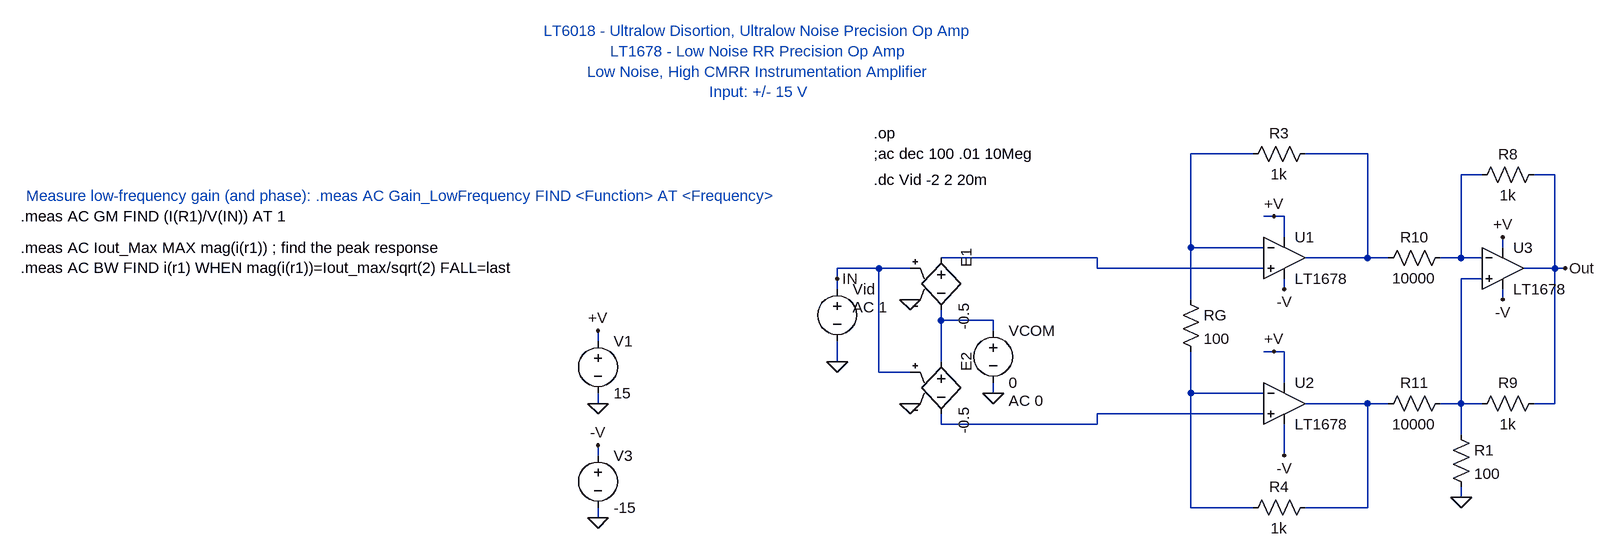
[diagram p0: schematic AI_VI_Howland_Gm.asc]
AI_VI_Howland_Gm.asc, the LTspice schematic file:
Version 4
SHEET 1 2004 1192
WIRE 416 48 320 48
WIRE 592 48 496 48
WIRE 768 80 736 80
WIRE 880 80 848 80
WIRE 448 144 432 144
WIRE 464 144 448 144
WIRE 464 176 464 144
WIRE 320 192 320 48
WIRE 432 192 320 192
WIRE 800 192 800 176
WIRE 176 208 -64 208
WIRE 592 208 592 48
WIRE 592 208 496 208
WIRE 624 208 592 208
WIRE 736 208 736 80
WIRE 736 208 704 208
WIRE 768 208 736 208
WIRE -160 224 -224 224
WIRE -112 224 -160 224
WIRE 176 224 176 208
WIRE 432 224 176 224
WIRE 880 224 880 80
WIRE 880 224 832 224
WIRE 896 224 880 224
WIRE -224 240 -224 224
WIRE 768 240 736 240
WIRE -224 256 -224 240
WIRE 464 256 464 240
WIRE 320 272 320 192
WIRE 800 272 800 256
WIRE -64 304 -64 288
WIRE 16 304 -64 304
WIRE 16 320 16 304
WIRE -592 336 -592 320
WIRE 448 352 432 352
WIRE 464 352 448 352
WIRE -224 368 -224 336
WIRE -64 368 -64 304
WIRE -160 384 -160 224
WIRE -112 384 -160 384
WIRE 464 400 464 352
WIRE 16 416 16 400
WIRE 320 416 320 352
WIRE 432 416 320 416
WIRE -592 432 -592 416
WIRE 592 432 496 432
WIRE 624 432 592 432
WIRE 736 432 736 240
WIRE 736 432 704 432
WIRE 768 432 736 432
WIRE 880 432 880 224
WIRE 880 432 848 432
WIRE 432 448 176 448
WIRE -64 464 -64 448
WIRE 176 464 176 448
WIRE 176 464 -64 464
WIRE 736 480 736 432
WIRE -592 512 -592 496
WIRE 464 512 464 464
WIRE 736 576 736 560
WIRE 320 592 320 416
WIRE 416 592 320 592
WIRE 592 592 592 432
WIRE 592 592 496 592
WIRE -592 608 -592 592
FLAG -592 432 0
FLAG -592 608 0
FLAG -592 320 +V
FLAG -592 496 -V
FLAG 448 144 +V
FLAG 16 416 0
FLAG 464 512 -V
FLAG 896 224 Out
FLAG 800 176 +V
FLAG 800 272 -V
FLAG 448 352 +V
FLAG 464 256 -V
FLAG -224 240 IN
FLAG -224 368 0
FLAG -112 272 0
FLAG -112 432 0
FLAG 736 576 0
DATAFLAG 320 192 ""
DATAFLAG 592 208 ""
DATAFLAG 592 432 ""
DATAFLAG 880 224 ""
DATAFLAG 736 208 ""
DATAFLAG 736 256 ""
SYMBOL Opamps\\LT1678 800 224 R0
SYMATTR InstName U3
SYMBOL voltage -592 320 R0
WINDOW 123 0 0 Left 2
WINDOW 39 0 0 Left 2
SYMATTR InstName V1
SYMATTR Value 15
SYMBOL voltage -592 496 R0
WINDOW 123 0 0 Left 2
WINDOW 39 0 0 Left 2
SYMATTR InstName V3
SYMATTR Value -15
SYMBOL voltage -224 240 R0
WINDOW 123 24 44 Left 2
WINDOW 39 24 117 Left 2
WINDOW 3 24 72 Left 2
SYMATTR Value2 AC 1
SYMATTR Value ""
SYMATTR InstName Vid
SYMBOL res 864 64 R90
WINDOW 0 0 56 VBottom 2
WINDOW 3 32 56 VTop 2
SYMATTR InstName R8
SYMATTR Value 1k
SYMATTR SpiceLine tol=1 pwr=0.1
SYMBOL res 864 416 R90
WINDOW 0 0 56 VBottom 2
WINDOW 3 32 56 VTop 2
SYMATTR InstName R9
SYMATTR Value 1k
SYMATTR SpiceLine tol=1 pwr=0.1
SYMBOL res 720 192 R90
WINDOW 0 0 56 VBottom 2
WINDOW 3 32 56 VTop 2
SYMATTR InstName R10
SYMATTR Value 10000
SYMATTR SpiceLine tol=1 pwr=0.1
SYMBOL res 720 416 R90
WINDOW 0 0 56 VBottom 2
WINDOW 3 32 56 VTop 2
SYMATTR InstName R11
SYMATTR Value 10000
SYMATTR SpiceLine tol=1 pwr=0.1
SYMBOL res 304 256 R0
SYMATTR InstName RG
SYMATTR Value 100
SYMATTR SpiceLine tol=1 pwr=0.1
SYMBOL res 512 32 R90
WINDOW 0 0 56 VBottom 2
WINDOW 3 32 56 VTop 2
SYMATTR InstName R3
SYMATTR Value 1k
SYMATTR SpiceLine tol=1 pwr=0.1
SYMBOL res 512 576 R90
WINDOW 0 0 56 VBottom 2
WINDOW 3 32 56 VTop 2
SYMATTR InstName R4
SYMATTR Value 1k
SYMATTR SpiceLine tol=1 pwr=0.1
SYMBOL voltage 16 304 R0
WINDOW 123 24 124 Left 2
WINDOW 39 24 117 Left 2
SYMATTR Value2 AC 0
SYMATTR InstName VCOM
SYMATTR Value 0
SYMBOL e -64 192 R0
WINDOW 0 39 1 VRight 2
WINDOW 3 35 85 VRight 2
SYMATTR InstName E1
SYMATTR Value -0.5
SYMBOL e -64 352 R0
WINDOW 0 39 1 VRight 2
WINDOW 3 35 85 VRight 2
SYMATTR InstName E2
SYMATTR Value -0.5
SYMBOL res 720 464 R0
SYMATTR InstName R1
SYMATTR Value 100
SYMBOL Opamps\\LT1678 464 208 R0
SYMATTR InstName U1
SYMBOL Opamps\\LT1678 464 432 R0
SYMATTR InstName U2
TEXT -344 -32 Bottom 2 ;LT6018 - Ultralow Disortion, Ultralow Noise Precision Op Amp\nLT1678 - Low Noise RR Precision Op Amp\nLow Noise, High CMRR Instrumentation Amplifier\nInput: +/- 15 V
TEXT -168 48 Left 2 !;ac dec 100 .01 10Meg
TEXT -1480 144 Left 2 !.meas AC GM FIND (I(R1)/V(IN)) AT 1
TEXT -1472 112 Left 2 ;Measure low-frequency gain (and phase): .meas AC Gain_LowFrequency FIND <Function> AT <Frequency>
TEXT -1480 192 Left 2 !.meas AC Iout_Max MAX mag(i(r1)) ; find the peak response\n.meas AC BW FIND i(r1) WHEN mag(i(r1))=Iout_max/sqrt(2) FALL=last
TEXT -168 16 Left 2 !.op
TEXT -168 88 Left 2 !.dc Vid -2 2 20m

The netlist it stands for:
* AI_VI_Howland_Gm.asc
XU3 N005 N003 Out +V -V LT1678  ; pins In+ In- OUT V+ V-
V1 +V 0 15
V3 -V 0 -15
Vid IN 0 AC 1
R8 Out N003 1k tol=1 pwr=0.1
R9 Out N005 1k tol=1 pwr=0.1
R10 N003 N002 10000 tol=1 pwr=0.1
R11 N005 N008 10000 tol=1 pwr=0.1
RG N001 N007 100 tol=1 pwr=0.1
R3 N002 N001 1k tol=1 pwr=0.1
R4 N008 N007 1k tol=1 pwr=0.1
VCOM N006 0 0 AC 0
E1 N004 N006 IN 0 -0.5
E2 N006 N009 IN 0 -0.5
R1 N005 0 100
XU1 N004 N001 N002 +V -V LT1678  ; pins In+ In- OUT V+ V-
XU2 N009 N007 N008 +V -V LT1678  ; pins In+ In- OUT V+ V-
* LT6018 - Ultralow Disortion, Ultralow Noise Precision Op Amp
* LT1678 - Low Noise RR Precision Op Amp
* Low Noise, High CMRR Instrumentation Amplifier
* Input: +/- 15 V
;ac dec 100 .01 10Meg
.meas AC GM FIND (I(R1)/V(IN)) AT 1
* Measure low-frequency gain (and phase): .meas AC Gain_LowFrequency FIND <Function> AT <Frequency>
.meas AC Iout_Max MAX mag(i(r1)) ; find the peak response
.meas AC BW FIND i(r1) WHEN mag(i(r1))=Iout_max/sqrt(2) FALL=last
.op
.dc Vid -2 2 20m
.backanno
.end